# Altium schematic sheet LED strips.SchDoc
size A4
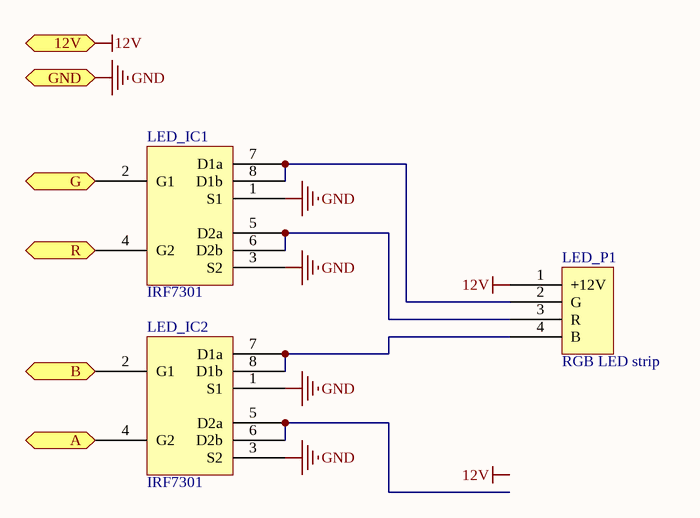
[diagram p0: LED strips.SchDoc]

## Parts
LED_IC1  IRF7301  [SOIC8]
LED_IC2  IRF7301  [SOIC8]
LED_P1  RGB LED strip  [LED strip RGB connector]

## Ports
12V (in), A (in), B (in), G (in), GND (in), R (in)

## Nets
12V: LED_P1.1(+12V) ; port 12V
GND: LED_IC1.1(S1) LED_IC1.3(S2) LED_IC2.1(S1) LED_IC2.3(S2) ; port GND
A: LED_IC2.4(G2) ; port A
B: LED_IC2.2(G1) ; port B
G: LED_IC1.2(G1) ; port G
R: LED_IC1.4(G2) ; port R
NetLED_IC1_5: LED_IC1.5(D2a) LED_IC1.6(D2b) LED_P1.3(R)
NetLED_IC1_7: LED_IC1.7(D1a) LED_IC1.8(D1b) LED_P1.2(G)
NetLED_IC2_5: LED_IC2.5(D2a) LED_IC2.6(D2b)
NetLED_IC2_7: LED_IC2.7(D1a) LED_IC2.8(D1b) LED_P1.4(B)

## Notes on the sheet
- Labels drawn without touching a wire or pin: 12V